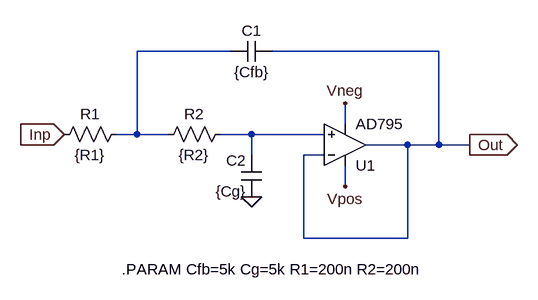
[diagram p0: schematic sallen_key_low_pass.asc]
sallen_key_low_pass.asc, the LTspice schematic file:
Version 4
SHEET 1 880 680
WIRE 96 -64 -48 -64
WIRE 416 -64 160 -64
WIRE 272 48 272 16
WIRE -48 64 -48 -64
WIRE -48 64 -80 64
WIRE 0 64 -48 64
WIRE 128 64 80 64
WIRE 240 64 128 64
WIRE 368 80 304 80
WIRE 416 80 416 -64
WIRE 416 80 368 80
WIRE 464 80 416 80
WIRE 128 96 128 64
WIRE 240 96 208 96
WIRE 272 144 272 112
WIRE 208 224 208 96
WIRE 368 224 368 80
WIRE 368 224 208 224
FLAG 128 160 0
FLAG 272 16 Vneg
FLAG 272 144 Vpos
FLAG -160 64 Inp
IOPIN -160 64 In
FLAG 464 80 Out
IOPIN 464 80 Out
SYMBOL OpAmps\\AD795 272 144 M180
SYMATTR InstName U1
SYMBOL res -16 80 R270
WINDOW 0 32 56 VTop 2
WINDOW 3 0 56 VBottom 2
SYMATTR InstName R2
SYMATTR Value {R2}
SYMBOL res -176 80 R270
WINDOW 0 32 56 VTop 2
WINDOW 3 0 56 VBottom 2
SYMATTR InstName R1
SYMATTR Value {R1}
SYMBOL cap 160 -80 R90
WINDOW 0 0 32 VBottom 2
WINDOW 3 32 32 VTop 2
SYMATTR InstName C1
SYMATTR Value {Cfb}
SYMBOL cap 144 160 R180
WINDOW 0 24 56 Left 2
WINDOW 3 24 8 Left 2
SYMATTR InstName C2
SYMATTR Value {Cg}
TEXT -72 272 Left 2 !.PARAM Cfb=5k Cg=5k R1=200n R2=200n

The netlist it stands for:
* sallen_key_low_pass.asc
XU1 N002 Out Vpos Vneg Out AD795  ; pins In+ In- V+ V- OUT
R2 N001 N002 {R2}
R1 Inp N001 {R1}
C1 Out N001 {Cfb}
C2 0 N002 {Cg}
.PARAM Cfb=5k Cg=5k R1=200n R2=200n
.lib ADI1.lib
.backanno
.end